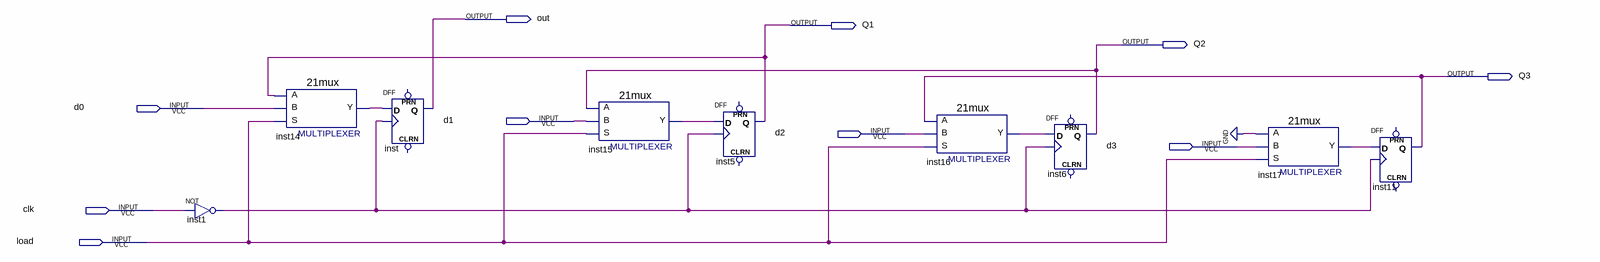
[diagram p0: schematic sheet]
// Quartus schematic Parallel_serial_reg_out_left.bdf as structural Verilog: 9 symbols, 10 pins
module Parallel_serial_reg_out_left (
  input  d0,
  input  d1,
  input  d2,
  input  d3,
  input  clk,
  input  load,
  output out,
  output Q1,
  output Q2,
  output Q3
);

  wire inst1_out, inst14_y, inst15_y, inst16_y, inst17_y;

  not inst1 (inst1_out, clk);
  \21mux  inst14 (.S(load), .B(d0), .A(Q1), .Y(inst14_y));
  DFF inst (.CLK(inst1_out), .D(inst14_y), .Q(out));  // open: CLRN, PRN
  \21mux  inst15 (.S(load), .B(d1), .A(Q2), .Y(inst15_y));
  DFF inst5 (.CLK(inst1_out), .D(inst15_y), .Q(Q1));  // open: CLRN, PRN
  \21mux  inst16 (.S(load), .B(d2), .A(Q3), .Y(inst16_y));
  DFF inst6 (.CLK(inst1_out), .D(inst16_y), .Q(Q2));  // open: CLRN, PRN
  \21mux  inst17 (.S(load), .B(d3), .A(1'b0), .Y(inst17_y));
  DFF inst11 (.CLK(inst1_out), .D(inst17_y), .Q(Q3));  // open: CLRN, PRN
endmodule
